# Altium schematic sheet Master.SchDoc: BMS Master
size A4; DrawnBy: Jonn Dillon; DocumentNumber: 1; Revision: 01; SheetNumber: 1; SheetTotal: 10; Version: 01; Project: Battery Managment System 2020; PageSetup: Record=PageOptions|CenterHorizontal=True|CenterVertical=True|PrintScale=0.97|XCorrection=1.00|YCorrection=1.00|PrintKind=0|BorderSize=5000000|LeftOffset=0|BottomOffset=0|Orientation=2|PaperLength=1000|PaperWidth=1000|Scale=100|PaperSource=7|PrintQuality=-4|MediaType=1|DitherType=10|PaperKind=A4|PrintScaleMode=1
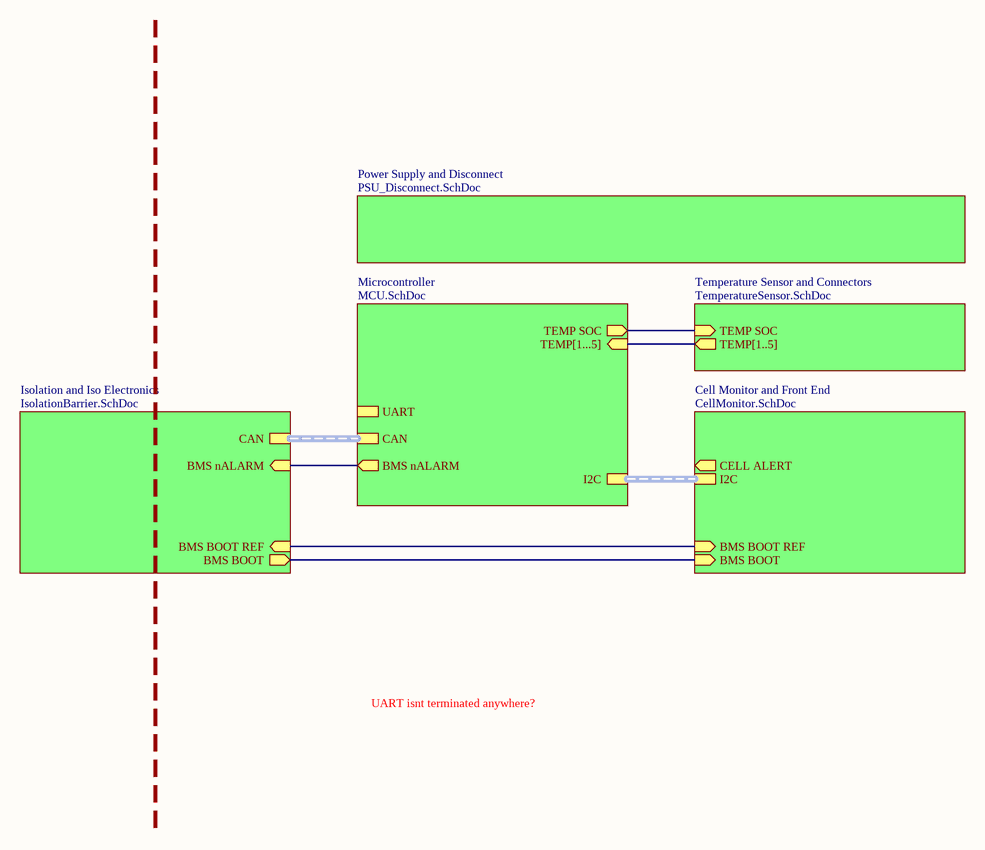
[diagram p0: Master.SchDoc]

## Sub-sheets
Cell Monitor and Front End = CellMonitor.SchDoc: BMS BOOT REF (in), BMS BOOT (in), I2C (harness I2C), CELL ALERT (out)
Isolation and Iso Electronics = IsolationBarrier.SchDoc: BMS BOOT (out), CAN (harness CANBUS SERIAL), BMS nALARM (in), BMS BOOT REF (in)
Microcontroller = MCU.SchDoc: I2C (harness I2C), CAN (harness CAN), TEMP[1...5] (in), BMS nALARM (out), TEMP SOC (out), UART (harness UART)
Power Supply and Disconnect = PSU_Disconnect.SchDoc: no entries
Temperature Sensor and Connectors = TemperatureSensor.SchDoc: TEMP SOC (in), TEMP[1..5] (out)

## Nets
(unnamed): sheet Isolation and Iso Electronics/BMS BOOT, sheet Cell Monitor and Front End/BMS BOOT
(unnamed): sheet Isolation and Iso Electronics/BMS nALARM, sheet Microcontroller/BMS nALARM
(unnamed): sheet Isolation and Iso Electronics/BMS BOOT REF, sheet Cell Monitor and Front End/BMS BOOT REF
(unnamed): sheet Microcontroller/TEMP SOC, sheet Temperature Sensor and Connectors/TEMP SOC

## Buses and harness runs
bus sheet Microcontroller/TEMP[1...5] = sheet Temperature Sensor and Connectors/TEMP[1..5]
harness sheet Cell Monitor and Front End/I2C = sheet Microcontroller/I2C
harness sheet Isolation and Iso Electronics/CAN = sheet Microcontroller/CAN

## Notes on the sheet
- UART isnt terminated anywhere?
- Revision History:
- Sheet Title:
- Rev
- Date
- Description
- Project:
- Size:
- Drawn By:
- A3
- Number:
- Revision:
- Sheet
- Version:
- of
- QUT Motorsport
- O-120, Gardens Point
- 2 George Street
- Brisbane, QLD 4000
- Australia
- Print Date:
- Print Time:
- File Name: